# EAGLE design JDM2_NoDIL (EAGLE 7.2.0)
JDM2 without DIL-Socket
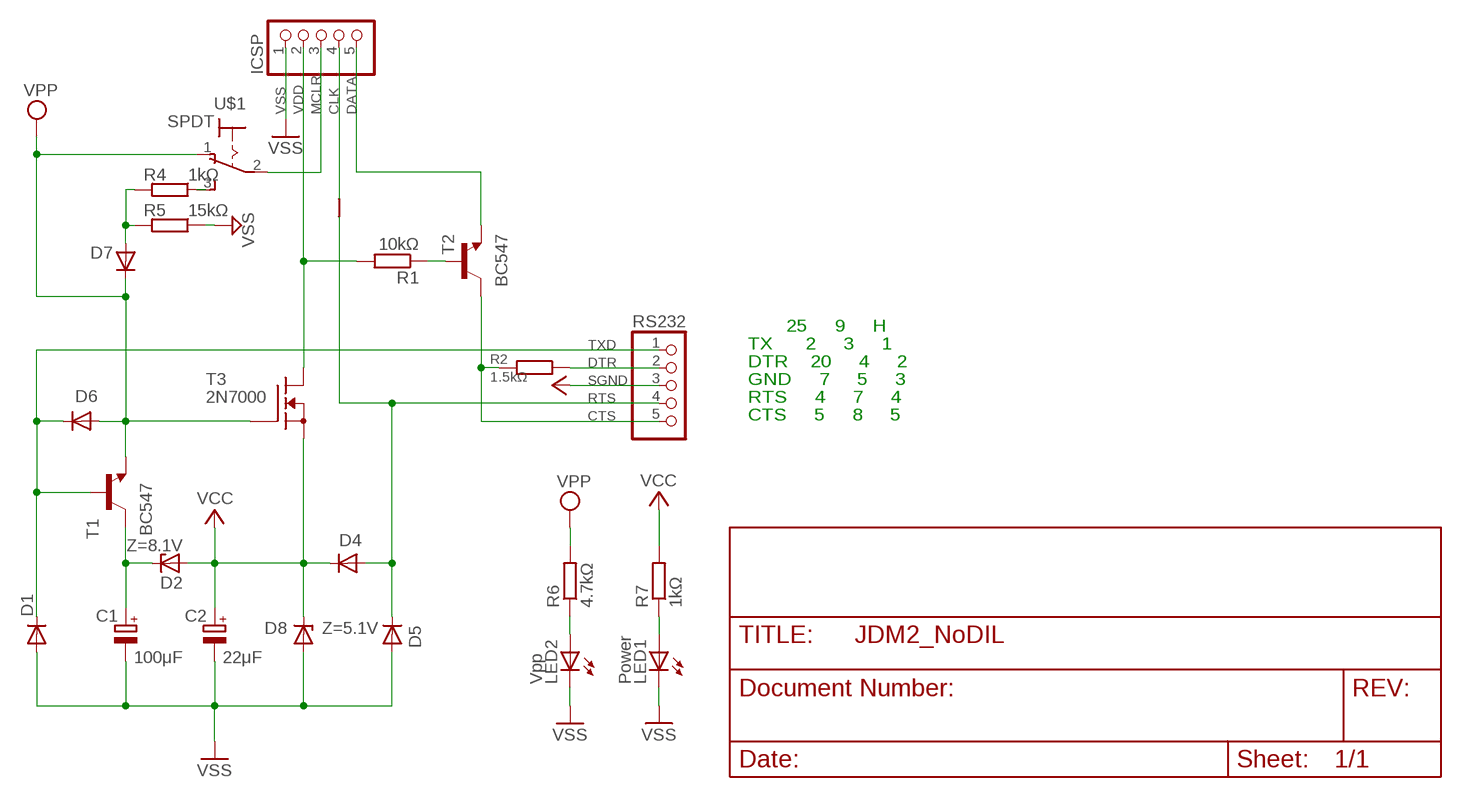
[diagram p0: schematic, sheet 1]

## Parts
C1  100μF  CPOL-EUE2.5-5  [E2,5-5]
C2  22μF  CPOL-EUE2.5-5  [E2,5-5]
D1  1N4148  1N4148-5  [DO35-5]
D2  Z=8.1V  Z-DIODEZ5  [DO35Z5]
D4  1N4148  1N4148-2.54  [DO35-2_54]
D5  1N4148  1N4148-15  [DO34-15]
D6  1N4148  1N4148-5  [DO35-5]
D7  2N4148  1N4148-5  [DO35-5]
D8  Z=5.1V  Z-DIODEZ10  [DO35Z10]
ICSP  PINHD-1X5  [1X05]
J1  DUMMY  [DUMMY]
LED1  Power  LED  [LED5MM]
LED2  Vpp  LED  [LED5MM]
R1  10kΩ  RES-0207-10  [0207/10]
R2  1.5kΩ  RES-0204-7  [0204/7]
R4  1kΩ  RES-0207-10  [0207/10]
R5  15kΩ  RES-0207-10  [0207/10]
R6  4.7kΩ  RES-0207-10  [0207/10]
R7  1kΩ  RES-0207-10  [0207/10]
RS232  PINHD-1X5  [1X05]
T1  BC547  [TO92-CBE]
T2  BC547  [TO92-CBE]
T3  2N7000  [TO92]
U$1  SPDT  [SPDT]

## Nets
2N3904: C1.+ D2.C T1.C
CLK: ICSP.4 J1.2
CTS: R2.2 RS232.5 T2.C
DATA: ICSP.5 T2.E
DTR: R2.1 RS232.2
MCLR: ICSP.3 U$1.2(P)
N$1: R1.1 T2.B
N$2: LED1.A R7.1
N$3: LED2.A R6.1
N$4: R4.1 U$1.3(S)
N$10: D7.A R4.2 R5.2
RTS: D4.A D5.C J1.1 RS232.4
SGND: C2.+ D2.A D4.C D8.C R7.2 RS232.3 T3.1(S) ; supply symbol labelled VCC
TXD: D1.C D6.C RS232.1 T1.B
VDD: ICSP.2 R1.2 T3.3(D)
VPP: D6.A D7.C R6.2 T1.E T3.2(G) U$1.1(O)
VSS: C1.- C2.- D1.A D5.A D8.A ICSP.1 LED1.K(C) LED2.K(C) R5.1

## Notes on the sheet
- 25     9     H
- TX      2     3     1
- DTR    20     4     2
- GND     7     5     3
- RTS     4     7     4
- CTS     5     8     5

## Library data of the parts
C1 C2 = rcl:CPOL-EU: POLARIZED CAPACITOR, European symbol
D1 D4-D7 = JDM2:1N4148
D2 D8 = JDM2:Z-DIODE
ICSP RS232 = pinhead:PINHD-1X5: PIN HEADER
J1 = JDM2:DUMMY
LED1 LED2 = 1dmf:LED
R1 R2 R4-R7 = JDM2:RES
T1 T2 = JDM2:BC547
T3 = JDM2:2N7000
U$1 = JDM2:SPDT

## Net classes
0 default: width 0.559 mm
1 power: width 0.559 mm

## Board
JDM2 without DIL-Socket
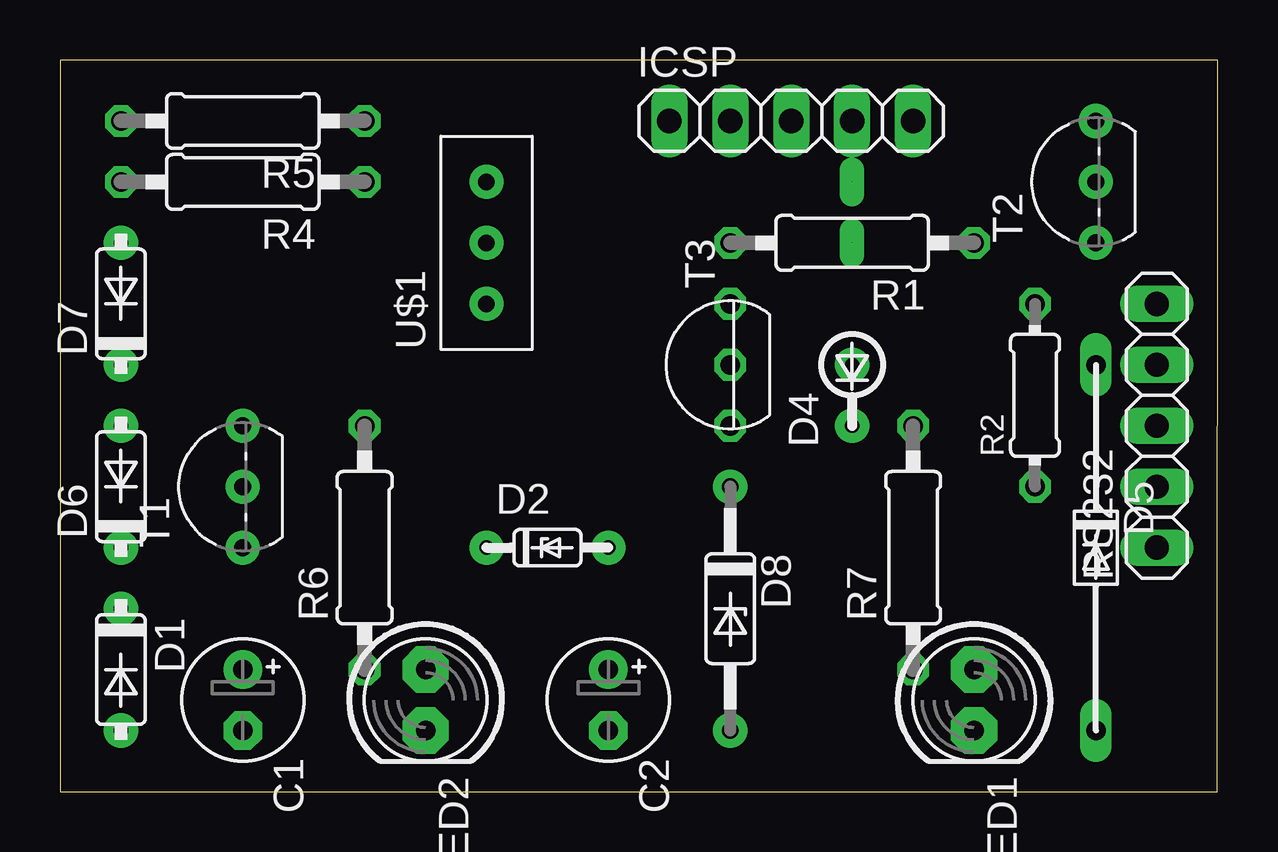
[diagram p1: board, top side]
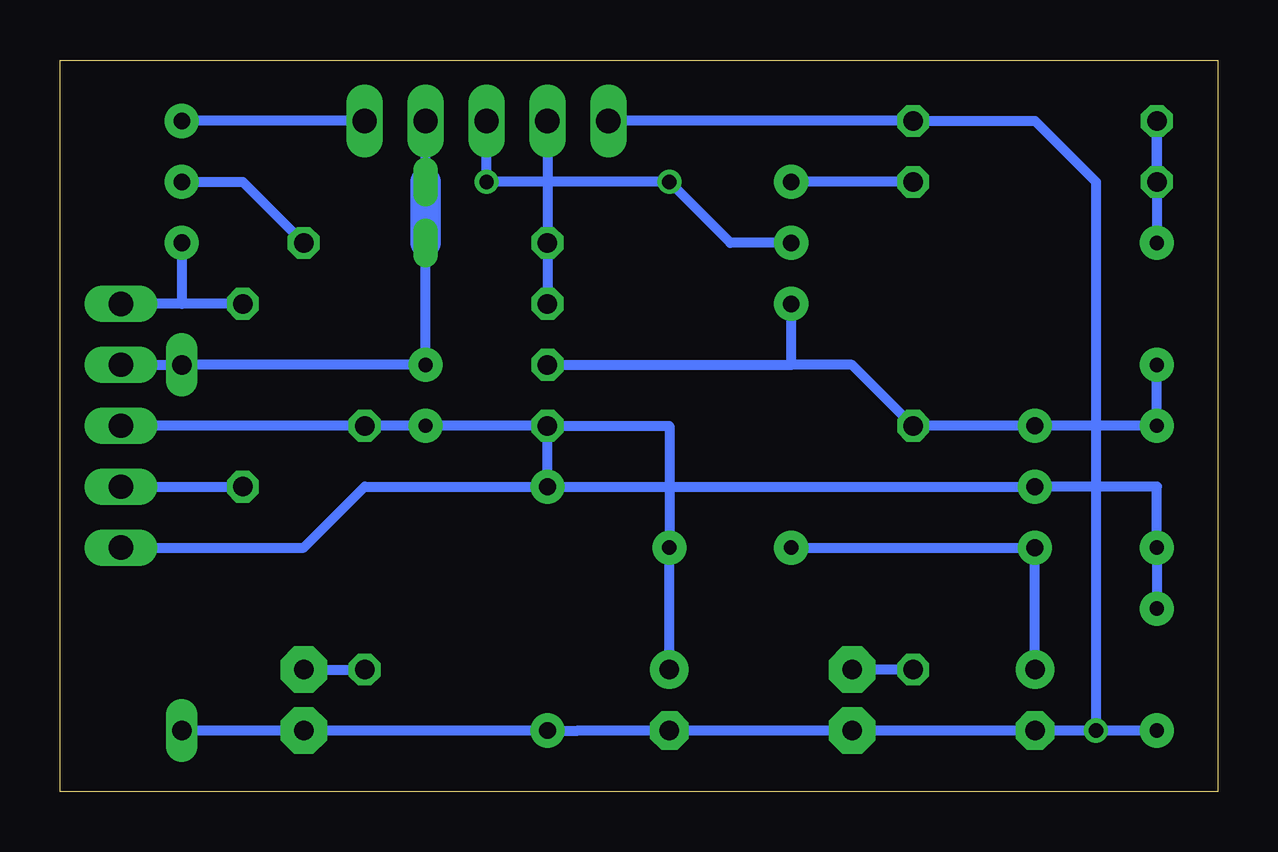
[diagram p2: board, bottom side, seen from below]

Size 48.26 x 30.48 mm. Coordinates in mm from the lower left corner, seen from the top.
Outline: 0,0 48.24,0 48.26,30.48 0,30.48 0,0
Copper layers (1*16): layer 1 0.035mm / dielectric 1.5mm / Bottom 0.035mm
Design rules "default": minimum track width 10mil, minimum drill 24mil, track to track 8mil, track to pad 8mil, pad to pad 8mil, via to via 8mil, smd to smd 8mil, copper to edge 40mil, drill to drill 8mil, minimum pad ring 10mil, minimum via ring 8mil, stop-mask expansion 4mil, vias tented up to drill 0mil, thermal gap 10mil

### Footprints (pad centres in the part's own frame; a part is rotated, then mirrored left to right if it is on the bottom)
E2,5-5 = drill 0.813 pad 1.6: + -1.27,0 | drill 0.813 pad 1.6 octagon: - 1.27,0
DO35-5 = drill 0.6 pad 1.422: A 2.54,0; C -2.54,0
DO35Z5 = drill 0.6 pad 1.422: A 2.54,0; C -2.54,0
DO35-2_54 = drill 0.6 pad 1.422: A 1.27,0; C -1.27,0
DO34-15 = drill 0.813 long: A 7.62,0; C -7.62,0
DO35Z10 = drill 0.7 pad 1.422: A 5.08,0; C -5.08,0
1X05 = drill 1.016 long: 1 -5.08,0; 2 -2.54,0; 3 0,0; 4 2.54,0; 5 5.08,0
DUMMY = drill 0.003 pad 1.016 long: 1 -1.27,0; 2 1.27,0
LED5MM = drill 0.813 pad 1.93 octagon: A -1.27,0; K 1.27,0
0207/10 = drill 0.813 octagon: 1 -5.08,0; 2 5.08,0
0204/7 = drill 0.813 octagon: 1 -3.81,0; 2 3.81,0
TO92-CBE = drill 0.7 pad 1.422: B 0,0; C -2.54,0; E 2.54,0
TO92 = drill 0.813 octagon: 1 -2.54,0; 2 0,0; 3 2.54,0
SPDT = drill 0.686 pad 1.422: 1 -2.54,0; 2 0,0; 3 2.54,0

### Placement (x,y rotation side)
C1  7.62,3.81 270 top
C2  22.86,3.81 270 top
D1  2.54,5.08 270 top
D2  20.32,10.16 0 top
D4  33.02,16.51 90 top
D5  43.18,10.16 270 top
D6  2.54,12.7 90 top
D7  2.54,20.32 90 top
D8  27.94,7.62 270 top
ICSP  30.48,27.94 0 top
J1  33.02,24.13 90 top
LED1  38.1,3.81 270 top
LED2  15.24,3.81 270 top
R1  33.02,22.86 180 top
R2  40.64,16.51 90 top
R4  7.62,25.4 180 top
R5  7.62,27.94 180 top
R6  12.7,10.16 90 top
R7  35.56,10.16 90 top
RS232  45.72,15.24 90 top
T1  7.62,12.7 90 top
T2  43.18,25.4 90 top
T3  27.94,17.78 90 top
U$1  17.78,22.86 90 top

### Tracks (layer width: path | path; a pad name or v marks a point on that pad's centre or on a via)
2N3904
  Bottom 0.406: D2.C T1.C C1.+
CLK
  Bottom 0.406: J1.2 ICSP.4
CTS
  Bottom 0.406: T2.C 43.18,20.32 RS232.5 R2.2
DATA
  Bottom 0.406: ICSP.5 T2.E
DTR
  Bottom 0.406: RS232.2 R2.1
MCLR  (via drill 0.6 layers 16-16)
  Bottom 0.406: U$1.2 20.32,22.86 v22.86,25.4 v30.48,25.4 ICSP.3
N$1
  Bottom 0.406: T2.B 40.64,25.4 R1.1
N$2
  Bottom 0.406: LED1.A R7.1
N$3
  Bottom 0.406: R6.1 LED2.A
N$4
  Bottom 0.406: R4.1 U$1.3
N$10
  Bottom 0.406: R4.2 R5.2 D7.A
RTS
  Bottom 0.406: RS232.4 D5.C D4.A J1.1
SGND
  Bottom 0.406: T3.1 D4.C R7.2 RS232.3 | C2.+ D2.A 22.86,15.24 T3.1 | D8.C T3.1
TXD
  Bottom 0.406: D1.C D6.C 2.54,12.7 T1.B 35.56,12.7 38.1,10.16 RS232.1
VDD
  Bottom 0.406: ICSP.2 R1.2 T3.3
VPP
  Bottom 0.406: 17.78,17.78 15.24,17.78 R6.2 T1.E D6.A D7.C | 17.78,17.78 U$1.1 | T3.2 17.78,17.78
VSS  (via drill 0.6 layers 16-16)
  Bottom 0.406: v5.08,2.54 5.08,25.4 7.62,27.94 R5.1 ICSP.1 | D5.A LED1.K D8.A 26.67,2.54 C2.- LED2.K C1.- v5.08,2.54 | D1.A v5.08,2.54